# EAGLE schematic c122-adsr (EAGLE 7.6.0)
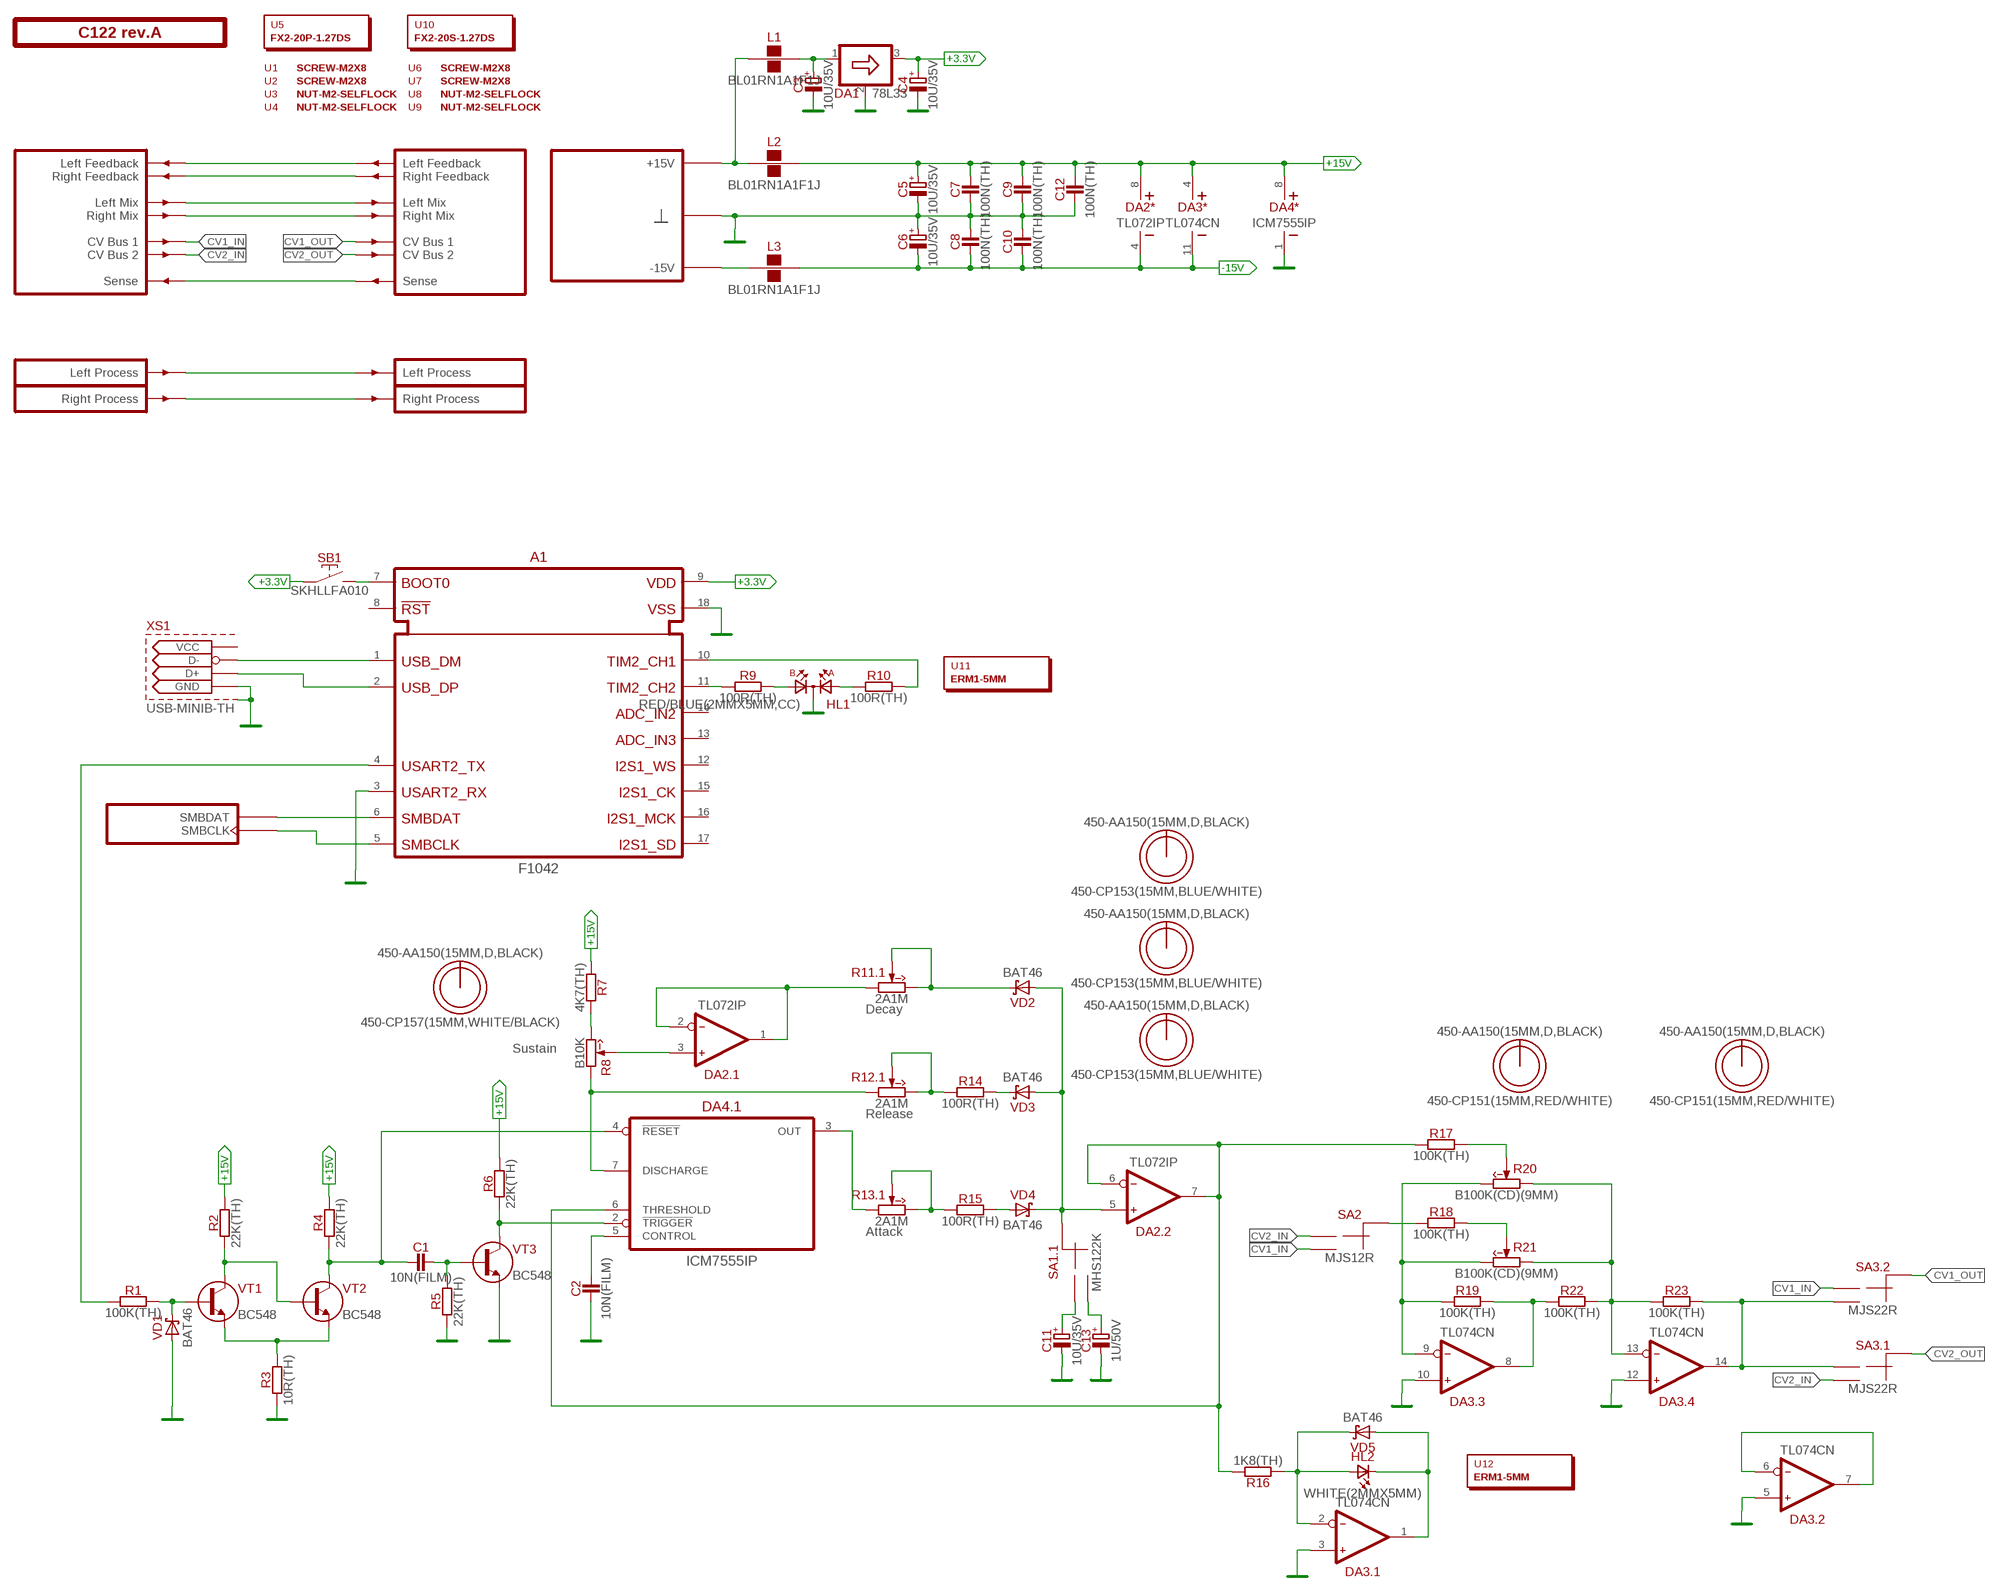
[diagram p0: schematic, sheet 1]

## Parts
A1  F1042  [F-DIP18]
C1  10N(FILM)  [C050-025X075]
C2  10N(FILM)  [C050-025X075]
C3  10U/35V  [E2-5]
C4  10U/35V  [E2-5]
C5  10U/35V  [E2-5]
C6  10U/35V  [E2-5]
C7  100N(TH)  [C050-024X044]
C8  100N(TH)  [C050-024X044]
C9  100N(TH)  [C050-024X044]
C10  100N(TH)  [C050-024X044]
C11  10U/35V  [E2-5]
C12  100N(TH)  [C050-024X044]
C13  1U/50V  [E1,5-4]
DA1  78L33  [TO92]
DA2  TL072IP  [DIP-8]
DA3  TL074CN  [DIP-14]
DA4  ICM7555IP  [DIP-8]
HL1  RED/BLUE(2MMX5MM,CC)  [LED2X5-3PIN]
HL2  WHITE(2MMX5MM)  [LED2X5]
L1  BL01RN1A1F1J  [BL01RN1A]
L2  BL01RN1A1F1J  [BL01RN1A]
L3  BL01RN1A1F1J  [BL01RN1A]
O1  450-AA150(15MM,D,BLACK)  [EMPTY]
O2  450-CP157(15MM,WHITE/BLACK)  [EMPTY]
O3  450-AA150(15MM,D,BLACK)  [EMPTY]
O4  450-CP153(15MM,BLUE/WHITE)  [EMPTY]
O5  450-AA150(15MM,D,BLACK)  [EMPTY]
O6  450-CP153(15MM,BLUE/WHITE)  [EMPTY]
O7  450-AA150(15MM,D,BLACK)  [EMPTY]
O8  450-CP153(15MM,BLUE/WHITE)  [EMPTY]
O9  450-AA150(15MM,D,BLACK)  [EMPTY]
O10  450-CP151(15MM,RED/WHITE)  [EMPTY]
O11  450-AA150(15MM,D,BLACK)  [EMPTY]
O12  450-CP151(15MM,RED/WHITE)  [EMPTY]
PCB1  C122 rev.A  ST2-BOARD-74  [ST2-BOARD-74]
R1  100K(TH)  [R-0207/10]
R2  22K(TH)  [R-0207/10]
R3  10R(TH)  [R-0207/10]
R4  22K(TH)  [R-0207/10]
R5  22K(TH)  [R-0207/10]
R6  22K(TH)  [R-0207/10]
R7  4K7(TH)  [R-0207/10]
R8  B10K  [RV11-SINGLE]
R9  100R(TH)  [R-0207/10]
R10  100R(TH)  [R-0207/10]
R11  2A1M  [RV11-DUAL]
R12  2A1M  [RV11-DUAL]
R13  2A1M  [RV11-DUAL]
R14  100R(TH)  [R-0207/10]
R15  100R(TH)  [R-0207/10]
R16  1K8(TH)  [R-0207/10]
R17  100K(TH)  [R-0207/10]
R18  100K(TH)  [R-0207/10]
R19  100K(TH)  [R-0207/10]
R20  B100K(CD)(9MM)  [RV09-SINGLE]
R21  B100K(CD)(9MM)  [RV09-SINGLE]
R22  100K(TH)  [R-0207/10]
R23  100K(TH)  [R-0207/10]
SA1  MHS122K  [APEM-MHS122K]
SA2  MJS12R  [APEM-MJS12R]
SA3  MJS22R  [APEM-MJS22R]
SB1  SKHLLFA010  [SKHLLFA010]
U1  SCREW-M2X8  [EMPTY]
U2  SCREW-M2X8  [EMPTY]
U3  NUT-M2-SELFLOCK  [EMPTY]
U4  NUT-M2-SELFLOCK  [EMPTY]
U5  FX2-20P-1.27DS  [EMPTY]
U6  SCREW-M2X8  [EMPTY]
U7  SCREW-M2X8  [EMPTY]
U8  NUT-M2-SELFLOCK  [EMPTY]
U9  NUT-M2-SELFLOCK  [EMPTY]
U10  FX2-20S-1.27DS  [EMPTY]
U11  ERM1-5MM  [EMPTY]
U12  ERM1-5MM  [EMPTY]
VD1  BAT46  [DO35-7]
VD2  BAT46  [DO35-7]
VD3  BAT46  [DO35-7]
VD4  BAT46  [DO35-7]
VD5  BAT46  [DO35-7]
VT1  BC548  [TO92]
VT2  BC548  [TO92]
VT3  BC548  [TO92]
XS1  USB-MINIB-TH  [USB-MB-H]

## Nets
+3.3V: A1.9(VDD) C4.+ DA1.3(OUT) SB1.1
+15V: C5.+ C7.2 C9.2 C12.2 DA2.8(*:V+) DA3.4(*:V+) DA4.8(*:V+) L2.2 R2.2 R4.2 R6.2 R7.2
-15V: C6.- C8.1 C10.1 DA2.4(*:V-) DA3.11(*:V-) L3.2
CV1_IN: PCB1.ACV1(CV1) SA2.NO SA3.NC2
CV1_OUT: PCB1.ACV1'(CV1') SA3.C2(.2:CM)
CV2_IN: PCB1.ACV2(CV2) SA2.NC SA3.NO1
CV2_OUT: PCB1.ACV2'(CV2') SA3.C1(.1:CM)
GND: A1.3(USART2_RX) A1.18(VSS) C2.1 C3.- C4.- C5.- C6.+ C7.1 C8.2 C9.1 C10.2 C11.- C12.1 C13.- DA1.2(GND) DA3.3(.1:IN+) DA3.5(.2:IN+) DA3.10(.3:IN+) DA3.12(.4:IN+) DA4.1(*:V-) HL1.K PCB1.B4'(GND) PCB1.B4(GND) PCB1.B5'(GND) PCB1.B5(GND) PCB1.B6'(GND) PCB1.B6(GND) PCB1.B7'(GND) PCB1.B7(GND) PCB1.B8'(GND) PCB1.B8(GND) R3.1 R5.1 VD1.A VT3.3(E) XS1.GND XS1.P$1(S1) XS1.P$2(S1) XS1.P$6(S1) XS1.P$7(S1)
LMIX: PCB1.ALMIX'(LMIX') PCB1.ALMIX(LMIX)
N$1: L1.1 L2.1 PCB1.A+15'(P+15V) PCB1.A+15(P+15V) PCB1.B+15'(P+15V) PCB1.B+15(P+15V)
N$2: PCB1.ALFBK'(LFBK') PCB1.ALFBK(LFBK)
N$3: C3.+ DA1.1(IN) L1.2
N$4: PCB1.ARFBK'(RFBK') PCB1.ARFBK(RFBK)
N$5: A1.11(TIM2_CH2) R9.1
N$6: A1.6(SBMDAT) PCB1.ASMBDAT'(SMBDAT) PCB1.ASMBDAT(SMBDAT)
N$7: A1.5(SMBCLK) PCB1.ASMBCLK'(SMBCLK) PCB1.ASMBCLK(SMBCLK)
N$8: A1.7(BOOT0) SB1.2
N$9: A1.1(USB_DM) XS1.D-
N$10: PCB1.BINL(INL) PCB1.BOUTL'(OUTL)
N$11: PCB1.BINR(INR) PCB1.BOUTR'(OUTR)
N$12: A1.2(USB_DP) XS1.D+
N$13: HL1.A2 R9.2
N$14: HL1.A1 R10.1
N$15: A1.10(TIM2_CH1) R10.2
N$16: PCB1.BSENSE'(SENSE') PCB1.BSENSE(SENSE)
N$17: DA4.3(.1:OUT) R13.1(.1:CCW)
N$18: R1.2 VD1.C VT1.2(B)
N$19: R3.2 VT1.3(E) VT2.3(E)
N$20: R2.1 VT1.1(C) VT2.2(B)
N$21: C1.1 DA4.4(.1:!RESET) R4.1 VT2.1(C)
N$22: R15.2 VD4.A
N$23: C1.2 R5.2 VT3.2(B)
N$24: DA4.2(.1:!TRIGGER) R6.1 VT3.1(C)
N$25: L3.1 PCB1.A-15'(P-15V) PCB1.A-15(P-15V) PCB1.B-15'(P-15V) PCB1.B-15(P-15V)
N$26: C2.2 DA4.5(.1:CONTROL)
N$27: A1.4(USART2_TX) R1.1
N$28: DA4.7(.1:DISCHARGE) R8.1(CCW) R12.1(.1:CCW)
N$29: R7.1 R8.3(CW)
N$30: DA2.1(.1:OUT) DA2.2(.1:IN-) R11.1(.1:CCW)
N$31: DA2.3(.1:IN+) R8.2(W)
N$32: R11.2(.1:W) R11.3(.1:CW) VD2.C
N$33: R12.2(.1:W) R12.3(.1:CW) R14.1
N$34: R13.2(.1:W) R13.3(.1:CW) R15.1
N$35: DA2.5(.2:IN+) SA1.CMN(.1:CM) VD2.A VD3.A VD4.C
N$36: DA3.2(.1:IN-) HL2.A R16.1 VD5.C
N$37: R18.2 R21.2(W)
N$38: R14.2 VD3.C
N$39: C11.+ SA1.1
N$41: DA3.1(.1:OUT) HL2.K(C) VD5.A
N$42: DA3.9(.3:IN-) R19.1 R20.3(CW) R21.3(CW)
N$43: C13.+ SA1.2
N$44: DA3.8(.3:OUT) R19.2 R22.1
N$45: DA3.13(.4:IN-) R20.1(CCW) R21.1(CCW) R22.2 R23.1
N$46: DA3.14(.4:OUT) R23.2 SA3.NC1 SA3.NO2
N$47: R18.1 SA2.C(CM)
N$48: R17.2 R20.2(W)
N$49: DA2.6(.2:IN-) DA2.7(.2:OUT) DA4.6(.1:THRESHOLD) R16.2 R17.1
N$51: DA3.6(.2:IN-) DA3.7(.2:OUT)
RMIX: PCB1.ARMIX'(RMIX') PCB1.ARMIX(RMIX)
Unconnected: A1.8(!RST) A1.12(I2S1_WS) A1.13(ADC_IN3) A1.14(ADC_IN2) A1.15(I2S1_CK) A1.16(I2S1_MCK) A1.17(I2S1_SD) R11.1'(.2:CCW) R11.2'(.2:W) R11.3'(.2:CW) R12.1'(.2:CCW) R12.2'(.2:W) R12.3'(.2:CW) R13.1'(.2:CCW) R13.2'(.2:W) R13.3'(.2:CW) SA1.1' SA1.2' SA1.CMN'(.2:CM) XS1.VBUS(VCC)

## Notes on the sheet
- Decay
- Sustain
- Release
- Attack

## Library data of the parts
A1 = module-footprints:F1042
C1 C2 = capacitors:?; MOUSER: 80-F622JF103J100C
C3-C6 C11 = capacitors-electrolytic:?; MOUSER: 647-USW1V100MDD
C7-C10 C12 = capacitors:?; MOUSER: 81-RCER71H104K0A2H3B
C13 = capacitors-electrolytic:?; MOUSER: 647-USW1H010MDD
DA1 = regulators-linear:78L33
DA2 = ic-ti:TL072; MOUSER: 595-TL072IP
DA3 = ic-ti:TL074
DA4 = ic-logic:ICM7555?
HL1 = optoelectronics:?(2MMX5MM,CC)
HL2 = optoelectronics:?(2MMX5MM)
L1-L3 = inductors:BL01RN1A?; MOUSER: 81-BL01RN1A1F1J
O1 O3 O5 O7 O9 O11 = hardware:450-AA?; MOUSER: 450-AA150
O2 = hardware:450-C?; MOUSER: 450-CP157
O4 O6 O8 = hardware:450-C?; MOUSER: 450-CP153
O10 O12 = hardware:450-C?
PCB1 = module-footprints:ST2-BOARD-?
R1 R17-R19 R22 R23 = resistors:?; MOUSER: 71-RN55D-F-100K
R2 R4-R6 = resistors:?; MOUSER: 71-CCF0722K0GKE36
R3 = resistors:?; MOUSER: 71-RN55D-F-10/R
R7 R16 = resistors:?
R8 = potentiometers:?; MOUSER: 652-PTV111-4425AB103
R9 R10 R14 R15 = resistors:?; MOUSER: 71-RN55D-F-100/R
R11-R13 = potentiometers:2**?; MOUSER: 317-2102F-1M
R20 R21 = potentiometers:?; MOUSER: 652-PTV09A-4225FB104
SA1 = switches:MHS122K; MOUSER: 642-MHS122K
SA2 = switches:MJS12R; MOUSER: 642-MJS12R
SA3 = switches:MJS22R; MOUSER: 642-MJS22R
SB1 = switches:SKHLLFA010; MOUSER: 688-SKHLLF
U1-U4 U6-U9 = hardware:*?
U5 = hardware:?; MOUSER: 798-FX2-20P-1.27DS71
U10 = hardware:?; MOUSER: 798-FX2-20S-1.27DS71
U11 U12 = hardware:?
VD1-VD5 = diodes-schottky:?; MOUSER: 511-BAT46
VT1-VT3 = transistors-npn:?
XS1 = connectors:USB-MINIB-TH